# Altium project Alles.PrjPcb
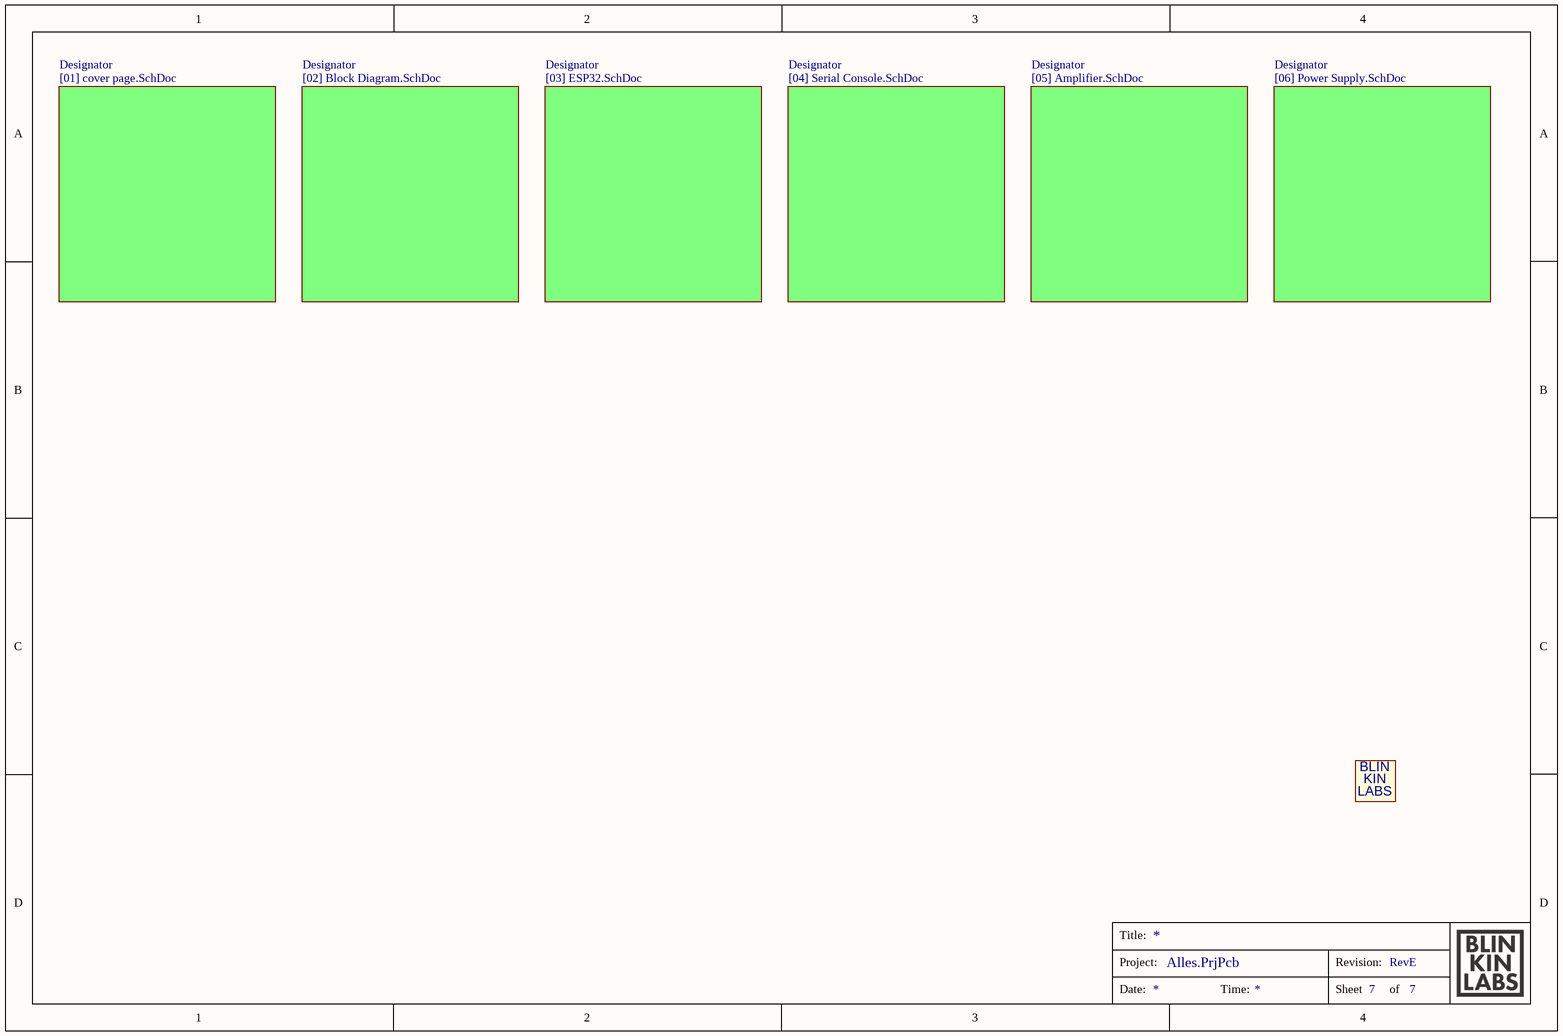
[diagram p0: Alles_base_project.SchDoc]
VersionRevision: RevE; Project: Alles
7 sheets, 72 parts. Net scope: flat (ports and power ports of the same name join across sheets).
Board file: Alles.PcbDoc
Sheets:
  Alles_base_project.SchDoc
    Designator = [03] ESP32.SchDoc
    Designator = [01] Cover Page.SchDoc
    Designator = [02] Block Diagram.SchDoc
    Designator = [04] Serial Console.SchDoc
    Designator = [06] Power Supply.SchDoc
    Designator = [05] Amplifier.SchDoc

## Sheet Alles_base_project.SchDoc
size A4; Organization: Blinkinlabs, LLC; DocumentNumber: 7; SheetNumber: 7; SheetTotal: 7

### Parts
L1  BLINKINLABS_LOGO  [BLINKINLABS_LOGO_SMALL]  (value not drawn)  (no BOM)

### Sub-sheets
Designator = [03] ESP32.SchDoc: no entries
Designator = [01] cover page.SchDoc: no entries
Designator = [02] Block Diagram.SchDoc: no entries
Designator = [04] Serial Console.SchDoc: no entries
Designator = [06] Power Supply.SchDoc: no entries
Designator = [05] Amplifier.SchDoc: no entries

### Notes on the sheet
- Title:
- Project:
- Revision:
- Date:
- Time:
- Sheet
- of
- (in symbol BLINKINLABS_LOGO) BLIN; KIN; LABS

### Library data of the parts
L1 = BLINKINLABS_LOGO: Square logo

## Sheet [03] ESP32.SchDoc: ESP32
size A4; Organization: Blinkinlabs, LLC; DocumentNumber: 3; SheetNumber: 3; SheetTotal: 7
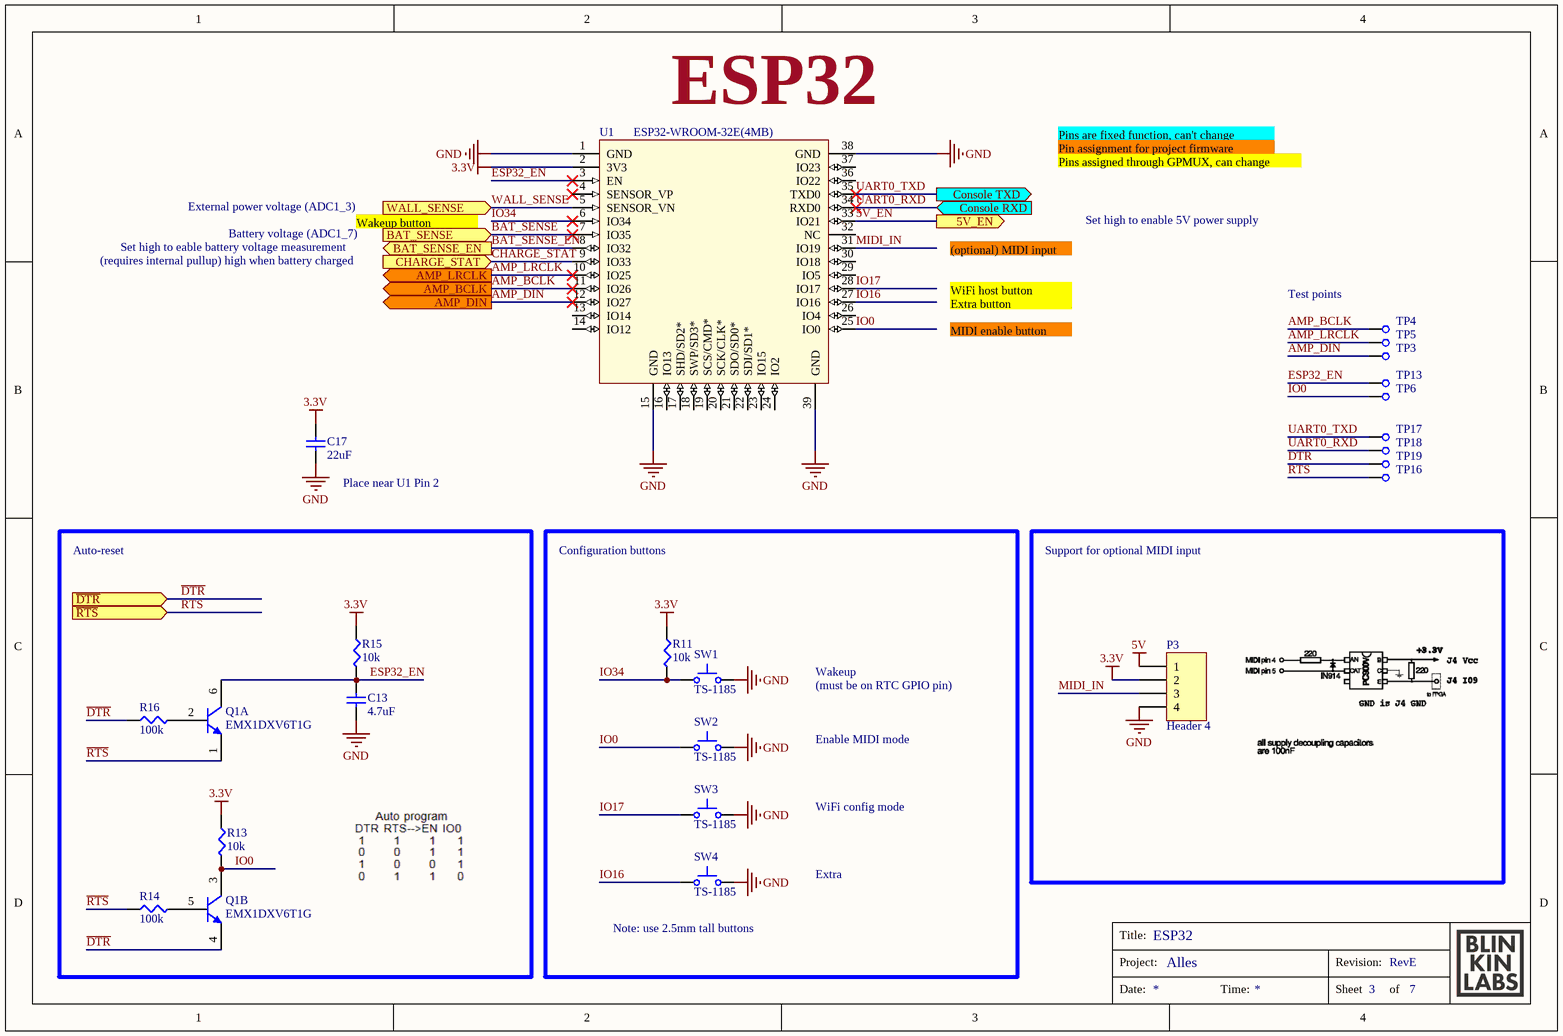
[diagram p1: [03] ESP32.SchDoc]

### Parts
C13  4.7uF  [CAPC1608X09L]
C17  22uF  [CAPC1608X09L]
P3  Header 4  [HDR1X4]
Q1  EMX1DXV6T1G  [ONSC-SOT-563-6-463A-01_V]  (parts A,B of 2)
R11  10k  [ERJ2G(0402)_L]
R13  10k  [ERJ2G(0402)_L]
R14  100k  [ERJ2G(0402)_L]
R15  10k  [ERJ2G(0402)_L]
R16  100k  [ERJ2G(0402)_L]
SW1  TS-1185  [TS-1185]
SW2  TS-1185  [TS-1185]
SW3  TS-1185  [TS-1185]
SW4  TS-1185  [TS-1185]
TP3  TEST_POINT  [TP-SMD-1mm]  (value not drawn)  (no BOM)
TP4  TEST_POINT  [TP-SMD-1mm]  (value not drawn)  (no BOM)
TP5  TEST_POINT  [TP-SMD-1mm]  (value not drawn)  (no BOM)
TP6  TEST_POINT  [TP-SMD-1mm]  (value not drawn)  (no BOM)
TP13  TEST_POINT  [TP-SMD-1mm]  (value not drawn)  (no BOM)
TP16  TEST_POINT  [TP-SMD-1mm]  (value not drawn)  (no BOM)
TP17  TEST_POINT  [TP-SMD-1mm]  (value not drawn)  (no BOM)
TP18  TEST_POINT  [TP-SMD-1mm]  (value not drawn)  (no BOM)
TP19  TEST_POINT  [TP-SMD-1mm]  (value not drawn)  (no BOM)
U1  ESP32-WROOM-32E(4MB)  [ESP32-WROOM-32-shortpad]

### Blocks framed on the sheet
Auto-reset: C13 Q1 R13-R16
Support for optional MIDI input: P3

### Ports
5V_EN (out), AMP_BCLK (out), AMP_DIN (out), AMP_LRCLK (out), BAT_SENSE (in), BAT_SENSE_EN (out), CHARGE_STAT (in), Console RXD (in), Console TXD (out), WALL_SENSE (in), ~{DTR} (in), ~{RTS} (in)

### Nets
3.3V: C17.1 P3.2 R11.1 R13.1 R15.1 U1.2(3V3)
5V: P3.1
GND: C13.2 C17.2 P3.4 SW1.2 SW2.2 SW3.2 SW4.2 U1.1(GND) U1.15(GND) U1.38(GND) U1.39(GND)
5V_EN: U1.33(IO21) ; port 5V_EN
AMP_BCLK: TP4.1(TP) U1.11(IO26) ; port AMP_BCLK
AMP_DIN: TP3.1(TP) U1.12(IO27) ; port AMP_DIN
AMP_LRCLK: TP5.1(TP) U1.10(IO25) ; port AMP_LRCLK
BAT_SENSE: U1.7(IO35) ; port BAT_SENSE
BAT_SENSE_EN: U1.8(IO32) ; port BAT_SENSE_EN
CHARGE_STAT: U1.9(IO33) ; port CHARGE_STAT
~{DTR}: Q1.4(E) R16.1 TP19.1(TP) ; port ~{DTR}
ESP32_EN: C13.1 Q1.6(C) R15.2 TP13.1(TP) U1.3(EN)
IO0: Q1.3(C) R13.2 SW2.1 TP6.1(TP) U1.25(IO0)
IO16: SW4.1 U1.27(IO16)
IO17: SW3.1 U1.28(IO17)
IO34: R11.2 SW1.1 U1.6(IO34)
MIDI_IN: P3.3 U1.31(IO19)
~{RTS}: Q1.1(E) R14.1 TP16.1(TP) ; port ~{RTS}
UART0_RXD: TP18.1(TP) U1.34(RXD0) ; port Console RXD
UART0_TXD: TP17.1(TP) U1.35(TXD0) ; port Console TXD
WALL_SENSE: U1.5(SENSOR_VN) ; port WALL_SENSE
NetQ1_2: Q1.2(B) R16.2
NetQ1_5: Q1.5(B) R14.2

Not connected (* = marked no-connect by the designer): U1 4(SENSOR_VP)* 13(IO14) 14(IO12) 16(IO13) 17(SHD/SD2*) 18(SWP/SD3*) 19(SCS/CMD*) 20(SCK/CLK*) 21(SDO/SD0*) 22(SDI/SD1*) 23(IO15) 24(IO2) 26(IO4) 29(IO5) 30(IO18) 32(NC) 36(IO22) 37(IO23)

### Notes on the sheet
- Pins are fixed function, can't change
- Pins assigned through GPMUX, can change
- Pin assignment for project firmware
- Set high to eable battery voltage measurement
- External power voltage (ADC1_3)
- Battery voltage (ADC1_7)
- Wakeup button
- (optional) MIDI input
- Set high to enable 5V power supply
- (requires internal pullup) high when battery charged
- Extra button
- WiFi host button
- Test points
- MIDI enable button
- (near C17) Place near U1 Pin 2
- Configuration buttons
- Wakeup
- (must be on RTC GPIO pin)
- Enable MIDI mode
- WiFi config mode
- Extra
- (near SW4) Note: use 2.5mm tall buttons
- Title:
- Project:
- Revision:
- Date:
- Time:
- Sheet
- of

### Library data of the parts
C13 = GRM185R61A475KE11D: CAP CER 4.7UF 10V X5R 0603; Manufacturer: Murata Electronics North America; Tolerance: ±10%; PartNumber: GRM185R61A475KE11D; Datasheets: http://www.murata.com/~/media/webrenewal/support/library/catalog/products/capacitor/mlcc/c02e.pdf; Image: //media.digikey.com/Renders/Murata%20Renders/ZRB-SERIES-0402.jpg; Digi-Key Part Number: 490-11988-1-ND; Series: GRM; Value: 4.7uF; Voltage: 10V; Temperature Coefficient: X5R; Operating Temperature: -55°C ~ 85°C; Features: -; Applications: General Purpose; Package / Case: 0603 (1608 Metric); Case/Package: 0603
C17 = GRM187R61A226ME15D: CAP CER 22UF 10V X5R 0603; Manufacturer: Murata Electronics North America; Tolerance: ±20%; PartNumber: GRM187R61A226ME15D; Datasheets: http://psearch.en.murata.com/capacitor/product/GRM187R61A226ME15%23.pdf; Image: //media.digikey.com/Renders/Murata%20Renders/ZRB-SERIES-0402.jpg; Digi-Key Part Number: 490-13243-1-ND; Series: GRM; Value: 22uF; Voltage: 10V; Temperature Coefficient: X5R; Operating Temperature: -55°C ~ 85°C; Features: Derating Recommended; Applications: General Purpose; Package / Case: 0603 (1608 Metric); Case/Package: 0603
P3 = Header 4: Header, 4-Pin; LatestRevisionDate: 17-Jul-2002; LatestRevisionNote: Re-released for DXP Platform.; Publisher: Altium Limited
Q1 = CMP-1048-00890-1: Dual NPN General Purpose Amplifier Transistors, 6-Pin SOT-563, Pb-Free, Tape and Reel; Manufacturer: On Semiconductor; IC Continuous (A): 0.1; ComponentLink3URL: http://www.onsemi.cn/pub_link/Collateral/463A-01.PDF; ComponentLink2URL: http://www.onsemi.com/pub_link/Collateral/EMX1DXV6T1-D.PDF; PackageDescription: 6-Pin Small Outline Transistor, Body 1.6 x 1.2 mm, Pitch 0.5 mm; ComponentLink1URL: http://www.onsemi.com/; ComponentLink1Description: Manufacturer URL; PartNumber: EMX1DXV6T1G; DatasheetVersion: Rev. 1; Polarity: Dual NPN; PackageReference: SOT-563-6-463A-01; RoHS: TRUE; ComponentLink2Description: Datasheet; Packing: Tape and Reel; Mounting Technology: Surface Mount; ComponentLink3Description: Package Specification; PackageVersion: Rev. F, 04/2005
R11 R13 R15 = ERJ-2GEJ103X: RES SMD 10K OHM 5% 1/10W 0402; Manufacturer: Panasonic Electronic Components; Power (Watts): 0.1W, 1/10W; Temperature Coefficient: ±200ppm/°C; PartNumber: ERJ-2GEJ103X; Datasheets: http://industrial.panasonic.com/www-cgi/jvcr13pz.cgi?E+PZ+3+AOA0001+ERJ2GEJ103X+7+WW; Image: //media.digikey.com/Photos/Panasonic%20Photos/ERJ-PA2-Series.jpg; Digi-Key Part Number: P10KJCT-ND; Series: ERJ; Value: 10k; Tolerance: ±5%; Composition: Thick Film; Features: Automotive AEC-Q200; Operating Temperature: -55°C ~ 155°C; Package / Case: 0402 (1005 Metric); Case/Package: 0402; Size / Dimension: 0.039" L x 0.020" W (1.00mm x 0.50mm); Height - Seated (Max): 0.016" (0.40mm); Number of Terminations: 2
R14 R16 = ERJ-2GEJ104X: RES SMD 100K OHM 5% 1/10W 0402; Manufacturer: Panasonic Electronic Components; Power (Watts): 0.1W, 1/10W; Temperature Coefficient: ±200ppm/°C; PartNumber: ERJ-2GEJ104X; Datasheets: http://industrial.panasonic.com/www-cgi/jvcr13pz.cgi?E+PZ+3+AOA0001+ERJ2GEJ104X+7+WW; Image: //media.digikey.com/Photos/Panasonic%20Photos/ERJ-PA2-Series.jpg; Digi-Key Part Number: P100KJCT-ND; Series: ERJ; Value: 100k; Tolerance: ±5%; Composition: Thick Film; Features: Automotive AEC-Q200; Operating Temperature: -55°C ~ 155°C; Package / Case: 0402 (1005 Metric); Case/Package: 0402; Size / Dimension: 0.039" L x 0.020" W (1.00mm x 0.50mm); Height - Seated (Max): 0.016" (0.40mm); Number of Terminations: 2
SW1-SW4 = TS-1185: Tact Switch, 3x4mm, no alignment pin, turtle style; Manufacturer: XKB; PartNumber: TS-1185
TP3-TP6 TP13 TP16-TP19 = TEST_POINT: Test point
U1 = ESP32-WROOM-32E(4MB): 32-bit MCU & 2.4 GHz Wi-Fi & Bluetooth/Bluetooth LE; Manufacturer: Espressif Systems; PartNumber: ESP32-WROOM-32E(4MB); LCSC PartNumber: C701341; Parameter 2: *

## Sheet [01] Cover Page.SchDoc: Cover Page
size A4; Organization: Blinkinlabs, LLC; DocumentNumber: 1; SheetNumber: 1; SheetTotal: 7
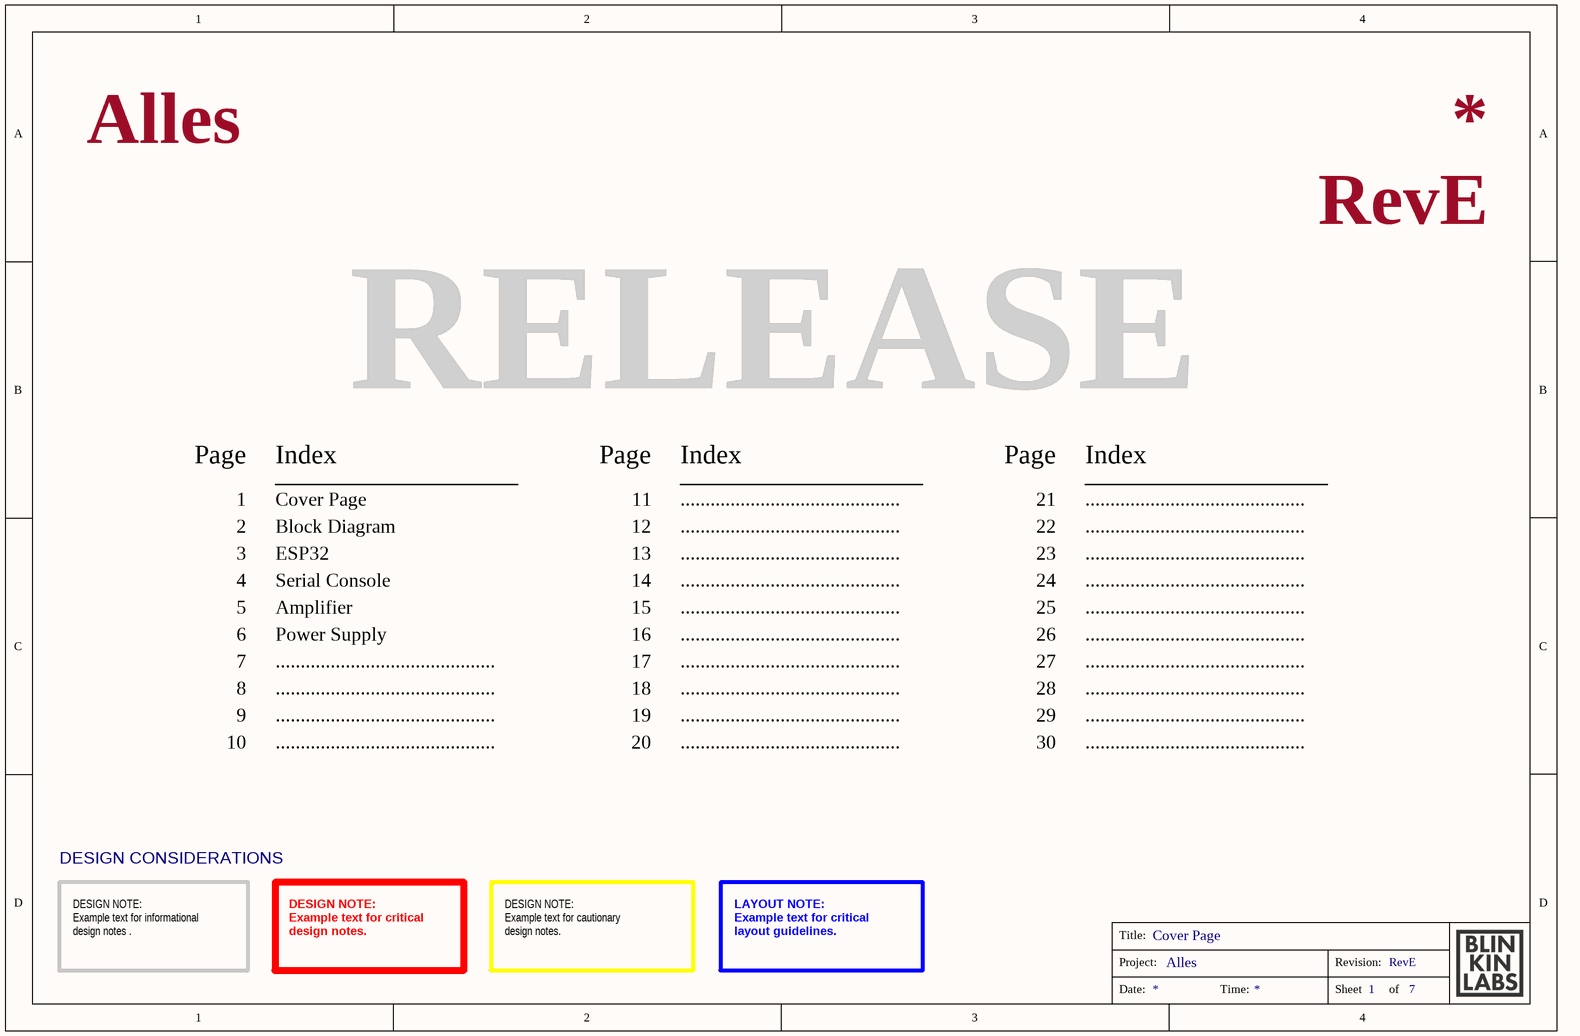
[diagram p2: [01] Cover Page.SchDoc]

### Notes on the sheet
- RELEASE
- Page
- 1
- Index
- Cover Page
- 11
- ............................................
- 21
- 2
- 3
- Block Diagram
- ESP32
- 12
- 13
- 22
- 23
- 4
- 5
- 6
- Serial Console
- Amplifier
- Power Supply
- 14
- 15
- 16
- 24
- 25
- 26
- 7
- 8
- 17
- 18
- 27
- 28
- 9
- 10
- 19
- 20
- 29
- 30
- DESIGN CONSIDERATIONS
- DESIGN NOTE:
  Example text for informational
  design notes .
- DESIGN NOTE:
  Example text for critical
  design notes.
- DESIGN NOTE:
  Example text for cautionary
  design notes.
- LAYOUT NOTE:
  Example text for critical
  layout guidelines.
- Title:
- Project:
- Revision:
- Date:
- Time:
- Sheet
- of

## Sheet [02] Block Diagram.SchDoc: Block Diagram
size A4; Organization: Blinkinlabs, LLC; DocumentNumber: 2; SheetNumber: 2; SheetTotal: 7
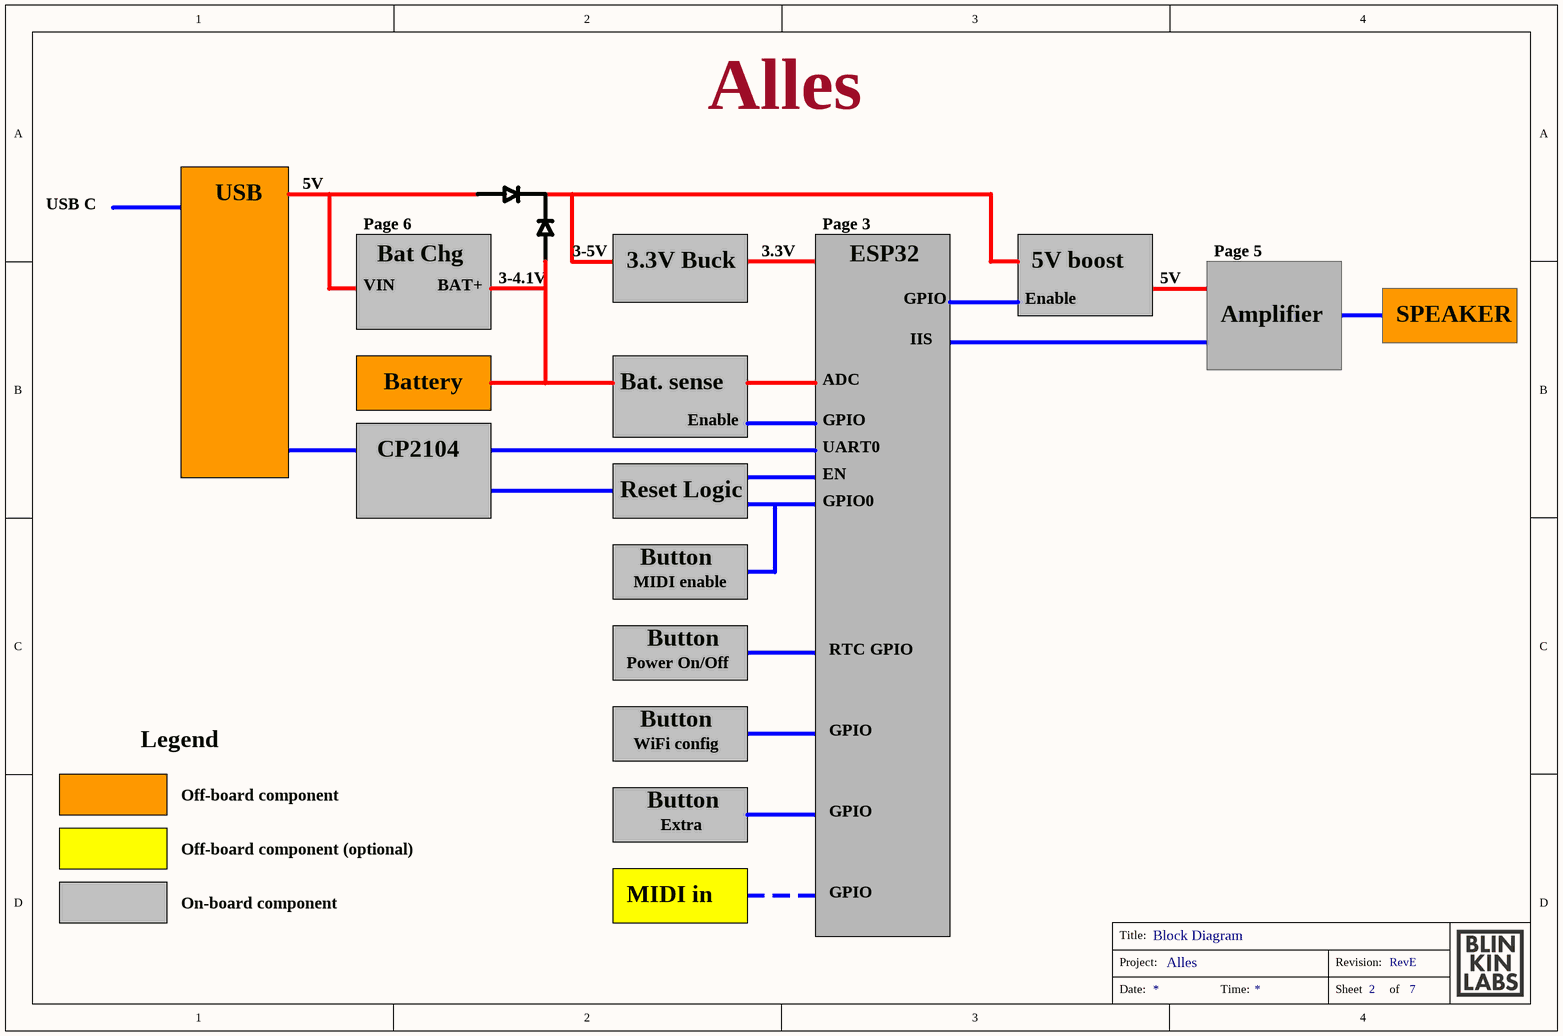
[diagram p3: [02] Block Diagram.SchDoc]

### Notes on the sheet
- USB C
- USB
- 5V
- Page 6
- Page 3
- VIN
- Bat Chg
- BAT+
- 3-4.1V
- 3-5V
- 3.3V Buck
- 3.3V
- ESP32
- GPIO
- Enable
- 5V boost
- Page 5
- ADC
- IIS
- Amplifier
- SPEAKER
- Battery
- Bat. sense
- CP2104
- Reset Logic
- UART0
- EN
- GPIO0
- Button
- MIDI enable
- RTC GPIO
- Power On/Off
- Legend
- Off-board component
- WiFi config
- Off-board component (optional)
- Extra
- On-board component
- MIDI in
- Title:
- Project:
- Revision:
- Date:
- Time:
- Sheet
- of

## Sheet [04] Serial Console.SchDoc: USB-to-Serial converter
size A4; Organization: Blinkinlabs, LLC; DocumentNumber: 4; SheetNumber: 4; SheetTotal: 7
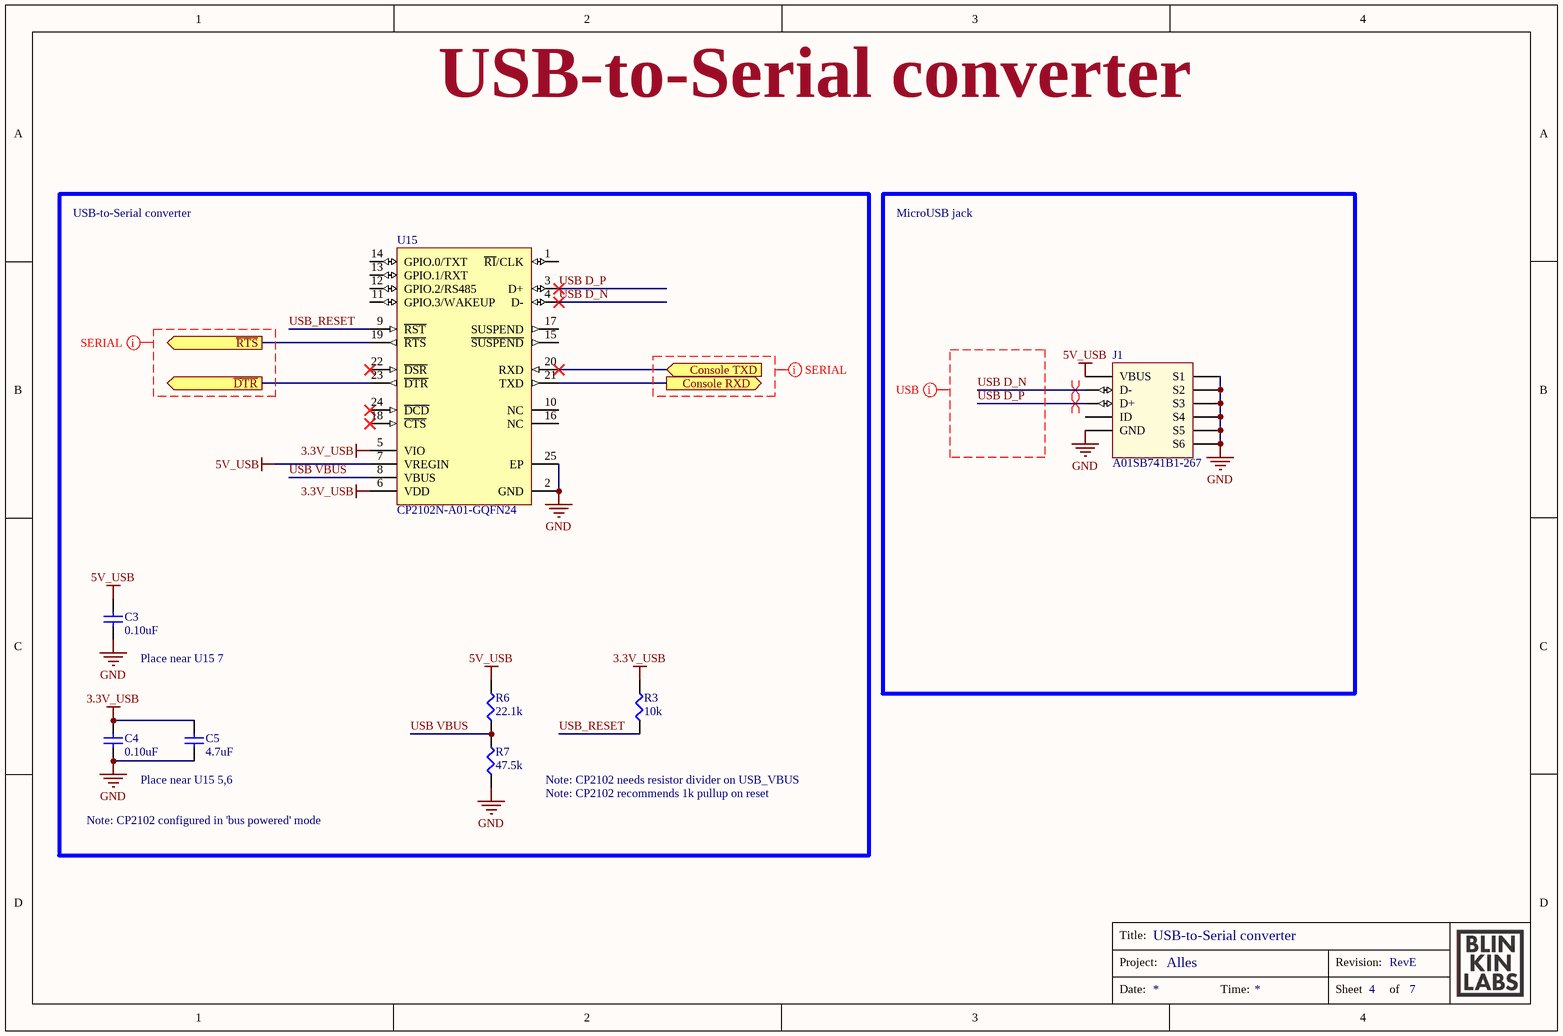
[diagram p4: [04] Serial Console.SchDoc]

### Parts
C3  0.10uF  [CAPC1005X06L]
C4  0.10uF  [CAPC1005X06L]
C5  4.7uF  [CAPC1608X09L]
J1  A01SB741B1-267  [A01SB741B1-267]
R3  10k  [ERJ2G(0402)_L]
R6  22.1k  [ERJ2G(0402)_L]
R7  47.5k  [ERJ2G(0402)_L]
U15  CP2102N-A01-GQFN24  [SLAB-QFN-24-2550x2550TP_A_V]

### Blocks framed on the sheet
MicroUSB jack: J1

### Ports
Console RXD (out), Console TXD (in), ~{DTR} (out), ~{RTS} (out)

### Nets
3.3V_USB: C4.2 C5.1 R3.2 U15.5(VIO) U15.6(VDD)
5V_USB: C3.2 J1.VBUS R6.2 U15.7(VREGIN)
GND: C3.1 C4.1 C5.2 J1.GND J1.S1 J1.S2 J1.S3 J1.S4 J1.S5 J1.S6 R7.1 U15.2(GND) U15.25(EP)
~{DTR}: U15.23(~{DTR}) ; port ~{DTR}
~{RTS}: U15.19(~{RTS}) ; port ~{RTS}
UART0_RXD: U15.21(TXD) ; port Console RXD
UART0_TXD: U15.20(RXD) ; port Console TXD
USB D_N: J1.D- U15.4(D-)
USB D_P: J1.D+ U15.3(D+)
USB VBUS: R6.1 R7.2 U15.8(VBUS)
USB_RESET: R3.1 U15.9(~{RST})

Not connected (* = marked no-connect by the designer): J1 ID; U15 1(~{RI}/CLK) 10(NC) 11(GPIO.3/WAKEUP) 12(GPIO.2/RS485) 13(GPIO.1/RXT) 14(GPIO.0/TXT) 15(~{SUSPEND}) 16(NC) 17(SUSPEND) 18(~{CTS})* 22(~{DSR})* 24(~{DCD})*

### Layout directives
net class USB: USB D_N, USB D_P
differential pair: USB D_N, USB D_P
net class SERIAL: (no net found under the mark)

### Notes on the sheet
- USB-to-Serial converter
- (near C3) Place near U15 7
- Place near U15 5,6
- Note: CP2102 needs resistor divider on USB_VBUS
- Note: CP2102 configured in 'bus powered' mode
- Note: CP2102 recommends 1k pullup on reset
- Title:
- Project:
- Revision:
- Date:
- Time:
- Sheet
- of

### Library data of the parts
C3 C4 = GRM152R61A104ME19D: CAP CER 0.1UF 10V X5R 0402; Manufacturer: Murata Electronics North America; Tolerance: ±20%; Datasheets: http://www.murata.com/~/media/webrenewal/support/library/catalog/products/capacitor/mlcc/c02e.pdf; Image: //media.digikey.com/Renders/Murata%20Renders/ZRB-SERIES-0402.jpg; Digi-Key Part Number: 490-10009-1-ND; Packaging: Cut Tape (CT); Series: GRM; Value: 0.10uF; Voltage: 10V; Temperature Coefficient: X5R; Operating Temperature: -55°C ~ 85°C; Features: Derating Recommended; Applications: General Purpose; Package / Case: 0402 (1005 Metric); Case/Package: 0402; PartNumber: GRM152R61A104ME19D
C5 = GRM185R61A475KE11D: as C13 on sheet [03] ESP32; PartNumber: GRM185R61A475KE11D; Datasheets: http://www.murata.com/~/media/webrenewal/support/library/catalog/products/capacitor/mlcc/c02e.pdf; Image: //media.digikey.com/Renders/Murata%20Renders/ZRB-SERIES-0402.jpg; Digi-Key Part Number: 490-11988-1-ND; Series: GRM; Value: 4.7uF; Voltage: 10V; Temperature Coefficient: X5R; Operating Temperature: -55°C ~ 85°C; Features: -; Applications: General Purpose; Package / Case: 0603 (1608 Metric); Case/Package: 0603
J1 = A01SB741B1-267: Micro USB B type 四脚全插牛角; PartNumber: Unknown/Generic; Manufacturer: Unknown/Generic
R3 = ERJ-2GEJ103X: as R11 on sheet [03] ESP32; PartNumber: ERJ-2GEJ103X; Datasheets: http://industrial.panasonic.com/www-cgi/jvcr13pz.cgi?E+PZ+3+AOA0001+ERJ2GEJ103X+7+WW; Image: //media.digikey.com/Photos/Panasonic%20Photos/ERJ-PA2-Series.jpg; Digi-Key Part Number: P10KJCT-ND; Series: ERJ; Value: 10k; Tolerance: ±5%; Composition: Thick Film; Features: Automotive AEC-Q200; Operating Temperature: -55°C ~ 155°C; Package / Case: 0402 (1005 Metric); Case/Package: 0402; Size / Dimension: 0.039" L x 0.020" W (1.00mm x 0.50mm); Height - Seated (Max): 0.016" (0.40mm); Number of Terminations: 2
R6 = ERJ-2RKF2212X: RES SMD 22.1K OHM 1% 1/10W 0402; Manufacturer: Panasonic Electronic Components; Power (Watts): 0.1W, 1/10W; Temperature Coefficient: ±100ppm/°C; PartNumber: ERJ-2RKF2212X; Datasheets: http://industrial.panasonic.com/www-cgi/jvcr13pz.cgi?E+PZ+3+AOA0002+ERJ2RKF2212X+7+WW; Image: //media.digikey.com/Photos/Panasonic%20Photos/ERJ-PA2-Series.jpg; Digi-Key Part Number: P22.1KLCT-ND; Series: ERJ; Value: 22.1k; Tolerance: ±1%; Composition: Thick Film; Features: Automotive AEC-Q200; Operating Temperature: -55°C ~ 155°C; Package / Case: 0402 (1005 Metric); Case/Package: 0402; Size / Dimension: 0.039" L x 0.020" W (1.00mm x 0.50mm); Height - Seated (Max): 0.016" (0.40mm); Number of Terminations: 2
R7 = ERJ-2RKF4752X: RES SMD 47.5K OHM 1% 1/10W 0402; Manufacturer: Panasonic Electronic Components; Power (Watts): 0.1W, 1/10W; Temperature Coefficient: ±100ppm/°C; PartNumber: ERJ-2RKF4752X; Datasheets: http://industrial.panasonic.com/www-cgi/jvcr13pz.cgi?E+PZ+3+AOA0002+ERJ2RKF4752X+7+WW; Image: //media.digikey.com/Photos/Panasonic%20Photos/ERJ-PA2-Series.jpg; Digi-Key Part Number: P47.5KLCT-ND; Series: ERJ; Value: 47.5k; Tolerance: ±1%; Composition: Thick Film; Features: Automotive AEC-Q200; Operating Temperature: -55°C ~ 155°C; Package / Case: 0402 (1005 Metric); Case/Package: 0402; Size / Dimension: 0.039" L x 0.020" W (1.00mm x 0.50mm); Height - Seated (Max): 0.016" (0.40mm); Number of Terminations: 2
U15 = CMP-2000-07570-1: USBXpress(TM) Family, 4 GPIOs, 2.2 to 3.6 V, -40 to 85 degC, 24-Pin QFN, RoHS; Manufacturer: Silicon Labs; Max Supply Voltage: 3.6V; Min Supply Voltage: 3V; Datasheet Version: Rev. 1.1, 08/2016; Max Operating Temperature: 85degC; Case\/Package: QFN; Number of Pins: 24; Min Operating Temperature: -40degC; Mounting Technology: SurfaceMount; Manufacturer URL: http://www.silabs.com/; RoHSCompliant: False; Package Reference: QFN-24-2550x2550TP_A; Datasheet URL: http://www.silabs.com/documents/public/data-sheets/cp2102n-datasheet.pdf; Package Description: 24-Pin Quad Flat No-lead Package, Body 4 x 4 mm, Pitch 0.5 mm; REACH SVHC: Unknown

## Sheet [06] Power Supply.SchDoc: Power Supply
size A4; Organization: Blinkinlabs, LLC; DocumentNumber: 6; SheetNumber: 6; SheetTotal: 7
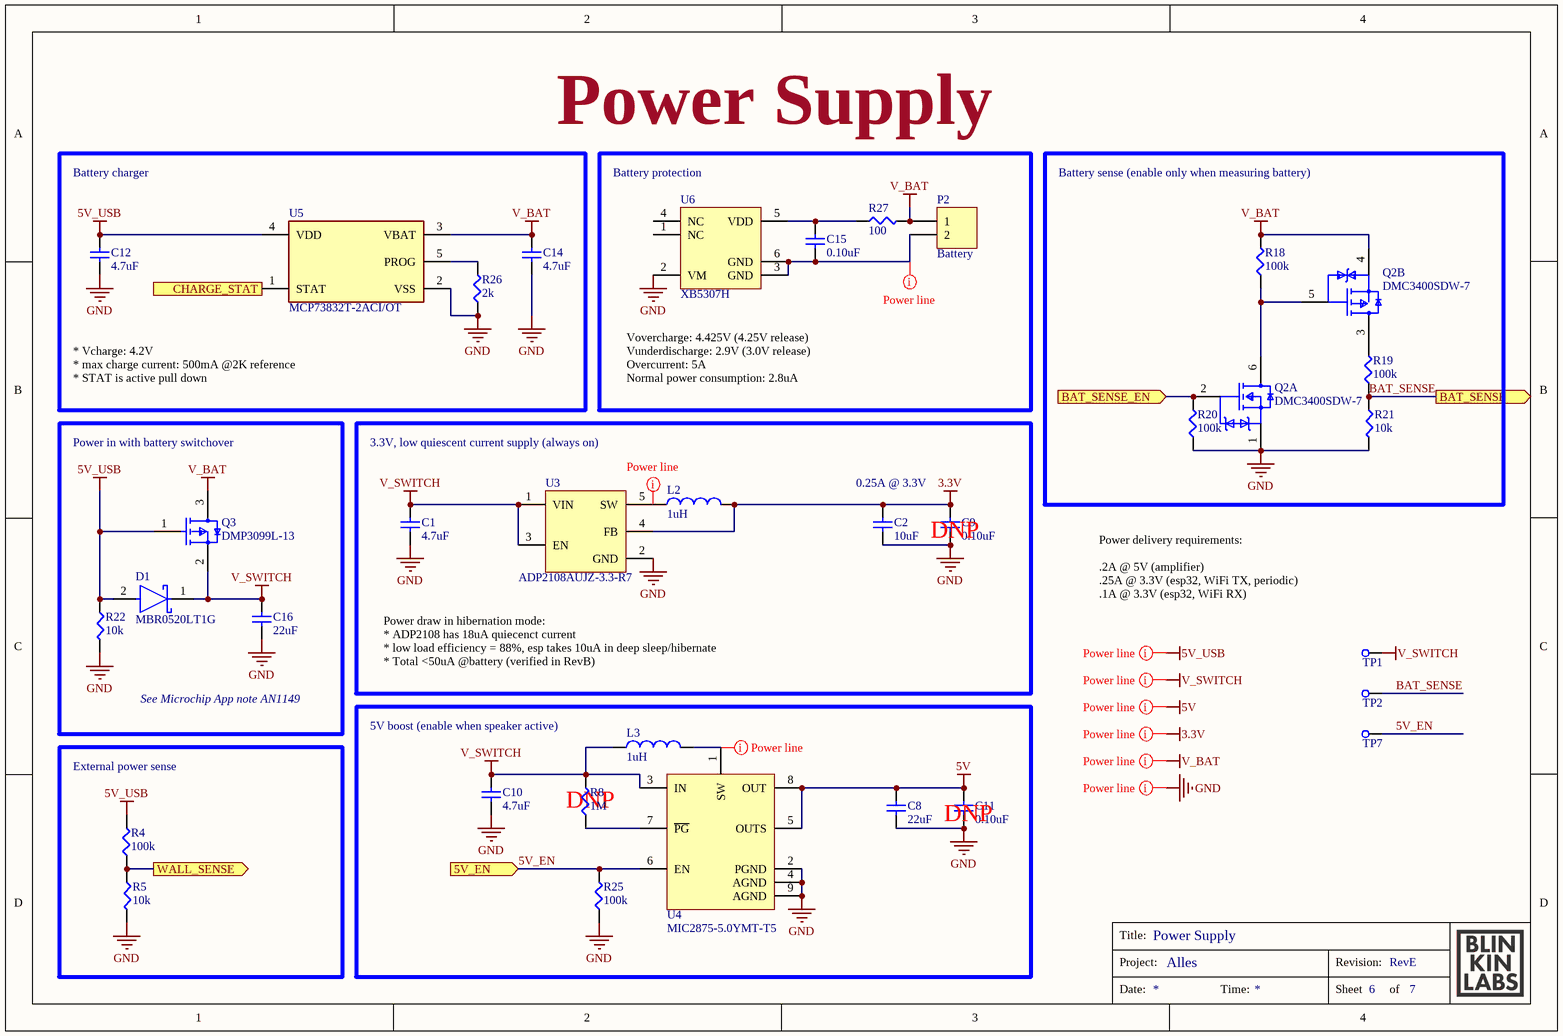
[diagram p5: [06] Power Supply.SchDoc]

### Parts
C1  4.7uF  [CAPC1608X09L]
C2  10uF  [CAPC1608X09L]
C8  22uF  [CAPC1608X09L]
C9  0.10uF  [CAPC1005X06L]
C10  4.7uF  [CAPC1608X09L]
C11  0.10uF  [CAPC1005X06L]
C12  4.7uF  [CAPC1608X09L]
C14  4.7uF  [CAPC1608X09L]
C15  0.10uF  [CAPC1005X06L]
C16  22uF  [CAPC1608X09L]
D1  MBR0520LT1G  [FP-425-04-IPC_C]
L2  1uH  [FNR201610S]
L3  1uH  [FNR201610S]
P2  Battery  [HDR1X2]
Q2  DMC3400SDW-7  [FP-SOT363-MFG]  (parts A,B of 2)
Q3  DMP3099L-13  [FP-SOT23-IPC_A]
R4  100k  [ERJ2G(0402)_L]
R5  10k  [ERJ2G(0402)_L]
R8  1M  [ERJ2G(0402)_L]
R18  100k  [ERJ2G(0402)_L]
R19  100k  [ERJ2G(0402)_L]
R20  100k  [ERJ2G(0402)_L]
R21  10k  [ERJ2G(0402)_L]
R22  10k  [ERJ2G(0402)_L]
R25  100k  [ERJ2G(0402)_L]
R26  2k  [ERJ2G(0402)_L]
R27  100  [ERJ2G(0402)_L]
TP1  TEST_POINT  [TP-SMD-1mm]  (value not drawn)  (no BOM)
TP2  TEST_POINT  [TP-SMD-1mm]  (value not drawn)  (no BOM)
TP7  TEST_POINT  [TP-SMD-1mm]  (value not drawn)  (no BOM)
U3  ADP2108AUJZ-3.3-R7  [SOT95P280X100-5N]
U4  MIC2875-5.0YMT-T5  [TDFN22-8LD-PL-1 (hand drawn)]
U5  MCP73832T-2ACI/OT  [FP-C04-091-OT-MFG]
U6  XB5307H  [SOT95P280X125-6N-3]

### Blocks framed on the sheet
Battery charger: C12 C14 R26 U5
Battery protection: C15 P2 R27 U6
Battery sense (enable only when measuring battery): Q2 R18-R21
DNP: C1 C2 C9 L2 U3
External power sense: R4 R5

### Ports
5V_EN (in), BAT_SENSE (out), BAT_SENSE_EN (in), CHARGE_STAT (out), WALL_SENSE (out)

### Nets
3.3V: C2.1 C9.2 L2.2 U3.4(FB)
5V: C8.1 C11.2 U4.5(OUTS) U4.8(OUT)
5V_USB: C12.1 D1.2(A) Q3.1(G) R4.2 R22.1 U5.4(VDD)
GND: C1.2 C2.2 C8.2 C9.1 C10.2 C11.1 C12.2 C14.2 C16.2 Q2.1(S1) R5.2 R20.1 R21.2 R22.2 R25.1 R26.1 U3.2(GND) U4.2(PGND) U4.4(AGND) U4.9(AGND) U5.2(VSS) U6.2(VM)
V_BAT: C14.1 P2.1 Q2.4(S2) Q3.3(D) R18.2 R27.2 U5.3(VBAT)
V_SWITCH: C1.1 C10.1 C16.1 D1.1(C) L3.1 Q3.2(S) R8.2 TP1.1(TP) U3.1(VIN) U3.3(EN) U4.3(IN)
5V_EN: R25.2 TP7.1(TP) U4.6(EN) ; port 5V_EN
BAT_SENSE: R19.1 R21.1 TP2.1(TP) ; port BAT_SENSE
BAT_SENSE_EN: Q2.2(G1) R20.2 ; port BAT_SENSE_EN
CHARGE_STAT: U5.1(STAT) ; port CHARGE_STAT
WALL_SENSE: R4.1 R5.1 ; port WALL_SENSE
NetC15_1: C15.1 P2.2 U6.3(GND) U6.6(GND)
NetC15_2: C15.2 R27.1 U6.5(VDD)
NetL2_1: L2.1 U3.5(SW)
NetL3_2: L3.2 U4.1(SW)
NetQ2_3: Q2.3(D2) R19.2
NetQ2_5: Q2.5(G2) Q2.6(D1) R18.1
NetR8_1: R8.1 U4.7(~{PG})
NetR26_2: R26.2 U5.5(PROG)

Not connected (* = marked no-connect by the designer): U6 1(NC) 4(NC)

### Layout directives
net class POWER: 3.3V, 5V, 5V_USB, GND, NetC15_1, NetL2_1, NetL3_2, V_BAT, V_SWITCH

### Notes on the sheet
- Vovercharge: 4.425V (4.25V release)
  Vunderdischarge: 2.9V (3.0V release)
  Overcurrent: 5A
  Normal power consumption: 2.8uA
- Power in with battery switchover
- * Vcharge: 4.2V
  * max charge current: 500mA @2K reference
  * STAT is active pull down
- 3.3V, low quiescent current supply (always on)
- 0.25A @ 3.3V
- (near TP1) Power delivery requirements:
  .2A @ 5V (amplifier)
  .25A @ 3.3V (esp32, WiFi TX, periodic)
  .1A @ 3.3V (esp32, WiFi RX)
- See Microchip App note AN1149
- Power draw in hibernation mode:
  * ADP2108 has 18uA quiecenct current
  * low load efficiency = 88%, esp takes 10uA in deep sleep/hibernate
  * Total <50uA @battery (verified in RevB)
- 5V boost (enable when speaker active)
- (near R8) DNP
- (near C11) DNP
- Labels drawn without touching a wire or pin: 3.3V, 5V, 5V_USB, GND, V_BAT, V_SWITCH
- Title:
- Project:
- Revision:
- Date:
- Time:
- Sheet
- of

### Library data of the parts
C1 C10 C12 C14 = GRM188R61A475KE15D: CAP CER 4.7UF 10V X5R 0603; Manufacturer: Murata Electronics North America; Tolerance: ±10%; PartNumber: GRM188R61A475KE15D; Datasheets: http://www.murata.com/~/media/webrenewal/support/library/catalog/products/capacitor/mlcc/c02e.pdf; Image: //media.digikey.com/Renders/Murata%20Renders/ZRB-SERIES-0402.jpg; Digi-Key Part Number: 490-10477-1-ND; Series: GRM; Value: 4.7uF; Voltage: 10V; Temperature Coefficient: X5R; Operating Temperature: -55°C ~ 85°C; Features: Derating Recommended; Applications: General Purpose; Package / Case: 0603 (1608 Metric); Case/Package: 0603
C2 = GRM188R61A106KE69D: CAP CER 10UF 10V X5R 0603; Manufacturer: Murata Electronics North America; Tolerance: ±10%; PartNumber: GRM188R61A106KE69D; Datasheets: http://www.murata.com/~/media/webrenewal/support/library/catalog/products/capacitor/mlcc/c02e.pdf; Image: //media.digikey.com/Renders/Murata%20Renders/ZRB-SERIES-0402.jpg; Digi-Key Part Number: 490-10474-1-ND; Series: GRM; Value: 10uF; Voltage: 10V; Temperature Coefficient: X5R; Operating Temperature: -55°C ~ 85°C; Features: Derating Recommended; Applications: General Purpose; Package / Case: 0603 (1608 Metric); Case/Package: 0603
C8 C16 = GRM187R61A226ME15D: as C17 on sheet [03] ESP32; PartNumber: GRM187R61A226ME15D; Datasheets: http://psearch.en.murata.com/capacitor/product/GRM187R61A226ME15%23.pdf; Image: //media.digikey.com/Renders/Murata%20Renders/ZRB-SERIES-0402.jpg; Digi-Key Part Number: 490-13243-1-ND; Series: GRM; Value: 22uF; Voltage: 10V; Temperature Coefficient: X5R; Operating Temperature: -55°C ~ 85°C; Features: Derating Recommended; Applications: General Purpose; Package / Case: 0603 (1608 Metric); Case/Package: 0603
C9 C11 C15 = GRM155R61C104KA88J: CAP CER 0.1UF 16V X5R 0402; Manufacturer: Murata Electronics North America; Tolerance: ±10%; PartNumber: GRM155R61C104KA88J; Datasheets: http://www.murata.com/~/media/webrenewal/support/library/catalog/products/capacitor/mlcc/c02e.pdf; Image: //media.digikey.com/Renders/Murata%20Renders/ZRB-SERIES-0402.jpg; Digi-Key Part Number: 490-6310-1-ND; Packaging: Cut Tape (CT); Series: GRM; Value: 0.10uF; Voltage: 16V; Temperature Coefficient: X5R; Operating Temperature: -55°C ~ 85°C; Features: -; Applications: General Purpose; Package / Case: 0402 (1005 Metric); Case/Package: 0402
D1 = CMP-1055-00425-2: DIODE SCHOTTKY 20V 500MA SOD123; Polarity: Standard; Peak Non-Repetitive Surge Current: 5.5A; Forward Voltage: 385mV; Element Configuration: Single; Peak Reverse Current: 250uA; Max Repetitive Reverse Voltage (Vrrm): 20V; Voltage Rating (DC): 20V; Case/Package: SOD-123-2; Number of Pins: 2; Output Current: 500mA; Min Operating Temperature: -65°C; Lead Free: Lead Free; REACH SVHC: No SVHC; Max Reverse Voltage (DC): 20V; Termination: SMD/SMT; Average Rectified Current: 500mA; Max Surge Current: 5.5A; Package Quantity: 3000; Height: 1.12mm; Current Rating: 500mA; Forward Current: 500mA; Max Forward Surge Current (Ifsm): 5.5A; Packaging: Tape and Reel; Length: 2.69mm; Radiation Hardening: No; Max Reverse Leakage Current: 250uA; Width: 1.6mm; Contact Plating: Tin; Max Operating Temperature: 125°C
L2 L3 = FNR201610S1R0MT: 1uH ±20% 1.45A 114mΩ SMD,2.0x1.6x1.0mm Power Inductors RoHS; Manufacturer: Changjiang Microelectronics Tech; PartNumber: FNR201610S1R0MT; Datasheets: https://datasheet.lcsc.com/szlcsc/1805291223_cjiang-Changjiang-Microelectronics-Tech-FNR201610S1R0MT_C167670.pdf; LCSC PartNumber: C167670; Inductance: 1uH; Tolerance: ±20%; DC Resistance: 114mΩ; Saturation current: 1.45A; Packaging: Cut Tape (CT); Package / Case: SMD,2.0x1.6x1.0mm; Case/Package: SMD,2.0x1.6x1.0mm
P2 = Header 2: Header, 2-Pin; LatestRevisionDate: 17-Jul-2002; LatestRevisionNote: Re-released for DXP Platform.; Publisher: Altium Limited
Q2 = CMP-12801-000006-1: MOSFET N/P-CH 30V SOT363; Manufacturer: Diodes Inc.; Standoff Height: 0mm; Number Of Channels: 2; Pulse Drain Current: 4/-3A; Max Forward Diode Voltage: 1.2/-1.2V; Max Junction Temp: +150°C; Drain To Source Resistance: 0.2/0.36Ω; Depletion Mode: False; Continuous Drain Current: 0.65/-0.45A; Number Of P Channels: 1; Drain To Source Breakdown Voltage: 30/-30V; Rthja Max: 406°C/W; Gate To Source Voltage: 20V; Power Dissipation: 0.31W; Turn On Delay Time: 3.8/5.7ns; Threshold Vgs Min: 0.8/-1V; Typ Forward Diode Voltage: 0.8/-0.8V; Turn Off Delay Time: 25.2/35ns; Threshold Vgs Max: 1.6/-2.6V; Lead Free: Yes; Temperature: -55°C to +150°C; Package: SOT363; Temperature Range High: +150°C; Height: 1.1mm; Device Class L2: Transistors; RoHS: TRUE; Category: Trans; Mouser Description: MOSFET 30V Comp Pair Enh 20Vgs 55pF 0.6nC; Device Class L3: MOSFETs; ComponentLink2Description: Datasheet; Automotive: No; ComponentLink2URL: https://www.diodes.com/assets/Datasheets/DMC3400SDW.pdf; Number Of N Channels: 1; Footprint Url: https://www.diodes.com/assets/Package-Files/SOT363.pdf; Digikey Description: MOSFET N/P-CH 30V SOT363; Device Class L1: Discrete Semiconductors; Manufacturer Part Number: DMC3400SDW-7; Drain To Source Voltage: 30/-30V; Ipc Land Pattern Name: SOT65P210X100-6; Temperature Range Low: -55°C; Octopart: https://octopart.com/dmc3400sdw-7-diodes+inc.-57605013
Q3 = CMP-12801-000102-1: MOSFET P-CH 30V 3.8A SOT23; Fall Time: 15ns; Turn-Off Delay Time: 31ns; Rds On Max: 65mR; Rise Time: 5ns; Gate to Source Voltage (Vgs): 20V; Number of Channels: 1; Max Power Dissipation: 1.08W; Turn-On Delay Time: 4.8ns; Element Configuration: Single; Input Capacitance: 563pF; Weight: 0.000282oz; Case/Package: TO-236-3; Drain to Source Voltage (Vdss): 30V; Package Quantity: 10000; Min Operating Temperature: -55°C; Radiation Hardening: No; REACH SVHC: No SVHC; Drain to Source Resistance: 65mR; Packaging: Tape and Reel; Lead Free: Lead Free; Number of Pins: 3; Mount: Surface Mount; Max Operating Temperature: 150°C; Continuous Drain Current (ID): 3.8A
R4 R18-R20 R25 = ERJ-2GEJ104X: as R14 on sheet [03] ESP32; PartNumber: ERJ-2GEJ104X; Datasheets: http://industrial.panasonic.com/www-cgi/jvcr13pz.cgi?E+PZ+3+AOA0001+ERJ2GEJ104X+7+WW; Image: //media.digikey.com/Photos/Panasonic%20Photos/ERJ-PA2-Series.jpg; Digi-Key Part Number: P100KJCT-ND; Series: ERJ; Value: 100k; Tolerance: ±5%; Composition: Thick Film; Features: Automotive AEC-Q200; Operating Temperature: -55°C ~ 155°C; Package / Case: 0402 (1005 Metric); Case/Package: 0402; Size / Dimension: 0.039" L x 0.020" W (1.00mm x 0.50mm); Height - Seated (Max): 0.016" (0.40mm); Number of Terminations: 2
R5 R21 R22 = ERJ-2GEJ103X: as R11 on sheet [03] ESP32; PartNumber: ERJ-2GEJ103X; Datasheets: http://industrial.panasonic.com/www-cgi/jvcr13pz.cgi?E+PZ+3+AOA0001+ERJ2GEJ103X+7+WW; Image: //media.digikey.com/Photos/Panasonic%20Photos/ERJ-PA2-Series.jpg; Digi-Key Part Number: P10KJCT-ND; Series: ERJ; Value: 10k; Tolerance: ±5%; Composition: Thick Film; Features: Automotive AEC-Q200; Operating Temperature: -55°C ~ 155°C; Package / Case: 0402 (1005 Metric); Case/Package: 0402; Size / Dimension: 0.039" L x 0.020" W (1.00mm x 0.50mm); Height - Seated (Max): 0.016" (0.40mm); Number of Terminations: 2
R8 = ERJ-2GEJ105X: RES SMD 1M OHM 5% 1/10W 0402; Manufacturer: Panasonic Electronic Components; Power (Watts): 0.1W, 1/10W; Temperature Coefficient: ±200ppm/°C; PartNumber: ERJ-2GEJ105X; Datasheets: http://industrial.panasonic.com/www-cgi/jvcr13pz.cgi?E+PZ+3+AOA0001+ERJ2GEJ105X+7+WW; Image: //media.digikey.com/Photos/Panasonic%20Photos/ERJ-PA2-Series.jpg; Digi-Key Part Number: P1.0MJCT-ND; Series: ERJ; Value: 1M; Tolerance: ±5%; Composition: Thick Film; Features: Automotive AEC-Q200; Operating Temperature: -55°C ~ 155°C; Package / Case: 0402 (1005 Metric); Case/Package: 0402; Size / Dimension: 0.039" L x 0.020" W (1.00mm x 0.50mm); Height - Seated (Max): 0.016" (0.40mm); Number of Terminations: 2
R26 = ERJ-2GEJ202X: RES SMD 2K OHM 5% 1/10W 0402; Manufacturer: Panasonic Electronic Components; Power (Watts): 0.1W, 1/10W; Temperature Coefficient: ±200ppm/°C; PartNumber: ERJ-2GEJ202X; Datasheets: http://industrial.panasonic.com/www-cgi/jvcr13pz.cgi?E+PZ+3+AOA0001+ERJ2GEJ202X+7+WW; Image: //media.digikey.com/Photos/Panasonic%20Photos/ERJ-PA2-Series.jpg; Digi-Key Part Number: P2.0KJCT-ND; Series: ERJ; Value: 2k; Tolerance: ±5%; Composition: Thick Film; Features: Automotive AEC-Q200; Operating Temperature: -55°C ~ 155°C; Package / Case: 0402 (1005 Metric); Case/Package: 0402; Size / Dimension: 0.039" L x 0.020" W (1.00mm x 0.50mm); Height - Seated (Max): 0.016" (0.40mm); Number of Terminations: 2
R27 = ERJ-2RKF1000X: RES SMD 100 OHM 1% 1/10W 0402; Manufacturer: Panasonic Electronic Components; Power (Watts): 0.1W, 1/10W; Temperature Coefficient: ±100ppm/°C; PartNumber: ERJ-2RKF1000X; Datasheets: http://industrial.panasonic.com/www-cgi/jvcr13pz.cgi?E+PZ+3+AOA0002+ERJ2RKF1000X+7+WW; Image: //media.digikey.com/Photos/Panasonic%20Photos/ERJ-PA2-Series.jpg; Digi-Key Part Number: P100LCT-ND; Series: ERJ; Value: 100; Tolerance: ±1%; Composition: Thick Film; Features: Automotive AEC-Q200; Operating Temperature: -55°C ~ 155°C; Package / Case: 0402 (1005 Metric); Case/Package: 0402; Size / Dimension: 0.039" L x 0.020" W (1.00mm x 0.50mm); Height - Seated (Max): 0.016" (0.40mm); Number of Terminations: 2
TP1 TP2 TP7 = TEST_POINT: Test point
U3 = ADP2108AUJZ-3.3-R7: Compact, 600 mA, 3 MHz, Step-Down DC-to-DC Converter, 3.3V; Manufacturer: *; PartNumber: ADP2108AUJZ-3.3-R7; DigiKey PartNumber: ADP2108AUJZ-3.3-R7CT-ND; LCSC PartNumber: C143875
U4 = MIC2875-5.0YMT-T5: 4.8A ISW, Synchronous Boost Regulator with Bi-Directional Load Disconnect; Manufacturer: Microchip; PartNumber: MIC2875-5.0YMT-T5; Digikey PartNumber: MIC2875-5.0YMT-T5CT-ND
U5 = CMP-0133-00138-2: IC LI-ION/LI-POLY CTRLR SOT23-5; Output Current: 10mA; Output Voltage: 4.2V; Max Output Current: 500mA; Max Power Dissipation: 1.54W; Min Output Voltage: 4.168V; Number of Channels: 1; Max Supply Voltage: 6V; Min Supply Voltage: 3.75V; Max Output Voltage: 4.5V; Case/Package: SOT-23; Lead Free: Lead Free; Termination: SMD/SMT; Min Operating Temperature: -40°C; Max Operating Temperature: 85°C; Height: 1.3mm; Length: 3.1mm; Mount: Surface Mount; Package Quantity: 3000; Number of Pins: 5; Packaging: Tape and Reel; REACH SVHC: No SVHC; Contact Plating: Tin; Width: 1.8mm; Number of Cells: 1; Number of Outputs: 1; Power Dissipation: 1.54W; Max Charge Current: 500mA; Max Input Voltage: 6V; Radiation Hardening: No
U6 = XB5307H: Single-cell Li-ion/Li-polymer rechargeable battery pack protection chip w2.90V cutorff; Manufacturer: XySemi; PartNumber: XB5307H; LCSC PartNumber: C154942

## Sheet [05] Amplifier.SchDoc: DAC
size A4; Organization: Blinkinlabs, LLC; DocumentNumber: 5; SheetNumber: 5; SheetTotal: 7
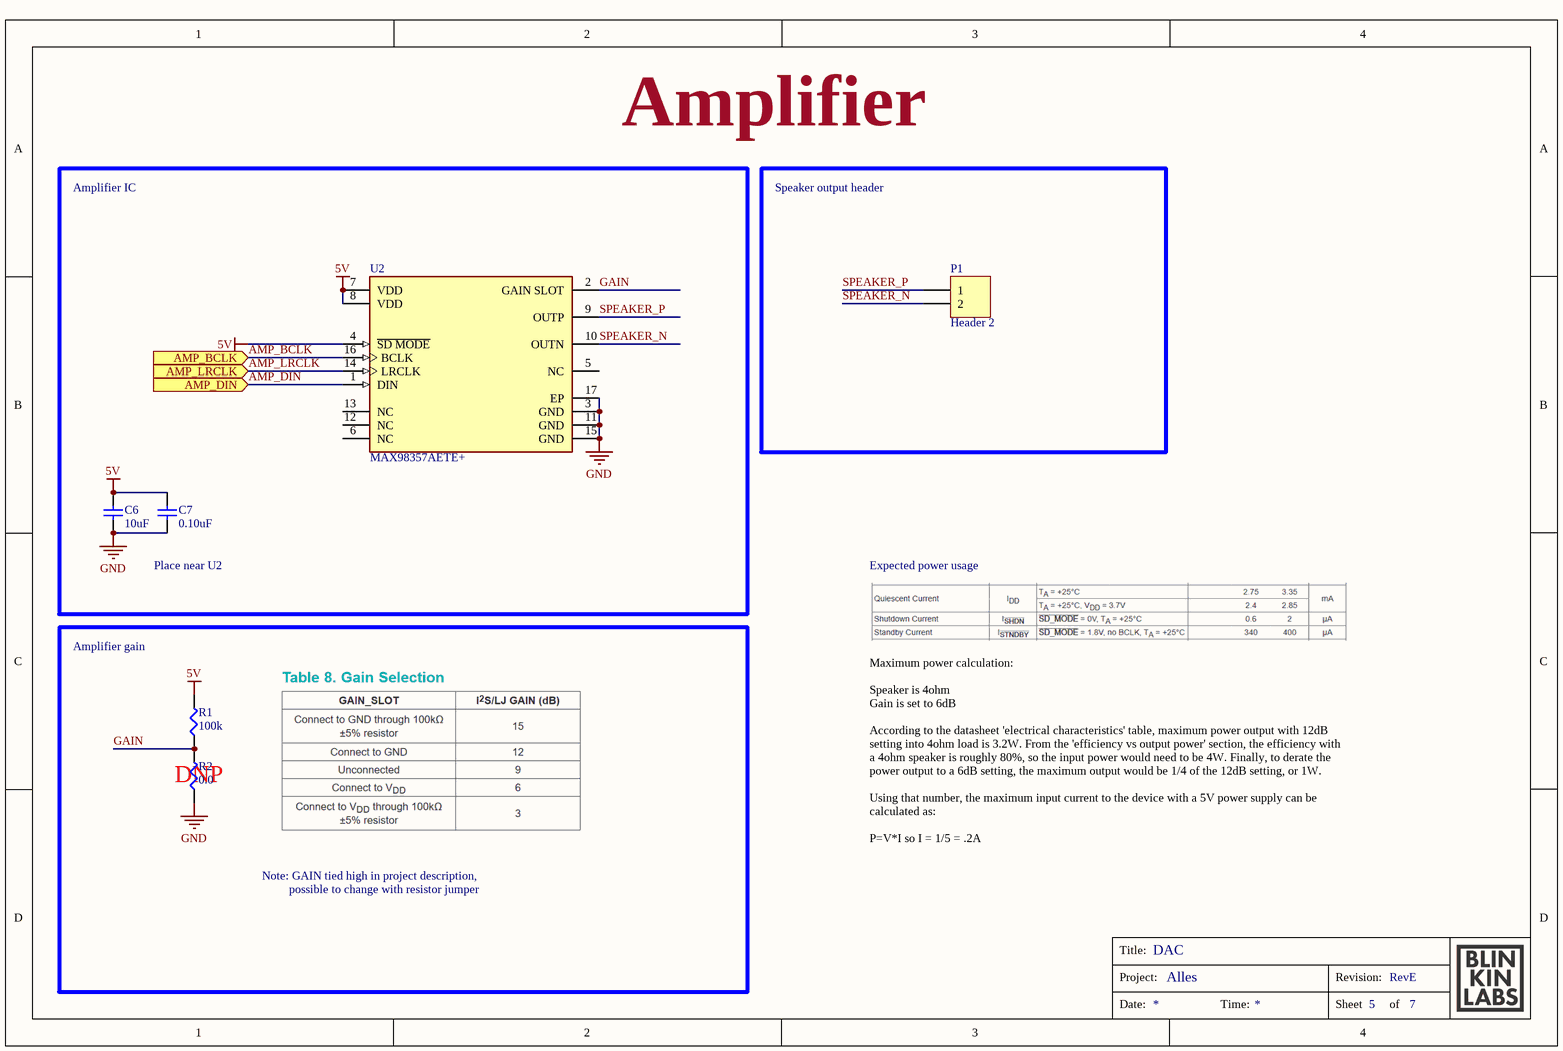
[diagram p6: [05] Amplifier.SchDoc]

### Parts
C6  10uF  [CAPC1608X09L]
C7  0.10uF  [CAPC1005X06L]
P1  Header 2  [HDR1X2]
R1  100k  [ERJ2G(0402)_L]
R2  0.0  [ERJ2G(0402)_L]
U2  MAX98357AETE+  [FP-T1633-4-MFG]

### Blocks framed on the sheet
Speaker output header: P1
DNP: R1 R2

### Ports
AMP_BCLK (in), AMP_DIN (in), AMP_LRCLK (in)

### Nets
5V: C6.1 C7.2 R1.2 U2.4(~{SD_MODE}) U2.7(VDD) U2.8(VDD)
GND: C6.2 C7.1 R2.1 U2.3(GND) U2.11(GND) U2.15(GND) U2.17(EP)
AMP_BCLK: U2.16(BCLK) ; port AMP_BCLK
AMP_DIN: U2.1(DIN) ; port AMP_DIN
AMP_LRCLK: U2.14(LRCLK) ; port AMP_LRCLK
GAIN: R1.1 R2.2 U2.2(GAIN_SLOT)
SPEAKER_N: P1.2 U2.10(OUTN)
SPEAKER_P: P1.1 U2.9(OUTP)

Not connected (* = marked no-connect by the designer): U2 5(NC) 6(NC) 12(NC) 13(NC)

### Notes on the sheet
- Amplifier
- Amplifier IC
- Place near U2
- Expected power usage
- Amplifier gain
- Maximum power calculation:
  Speaker is 4ohm
  Gain is set to 6dB
  According to the datasheet 'electrical characteristics' table, maximum power output with 12dB setting into 4ohm load is 3.2W. From the 'efficiency vs output power' section, the efficiency with a 4ohm speaker is roughly 80%, so the input power would need to be 4W. Finally, to derate the power output to a 6dB setting, the maximum output would be 1/4 of the 12dB setting, or 1W.
  Using that number, the maximum input current to the device with a 5V power supply can be calculated as:
  P=V*I so I = 1/5 = .2A
- Note: GAIN tied high in project description,
- possible to change with resistor jumper
- Title:
- Project:
- Revision:
- Date:
- Time:
- Sheet
- of

### Library data of the parts
C6 = GRM188R61A106KE69D: as C2 on sheet [06] Power Supply; PartNumber: GRM188R61A106KE69D; Datasheets: http://www.murata.com/~/media/webrenewal/support/library/catalog/products/capacitor/mlcc/c02e.pdf; Image: //media.digikey.com/Renders/Murata%20Renders/ZRB-SERIES-0402.jpg; Digi-Key Part Number: 490-10474-1-ND; Series: GRM; Value: 10uF; Voltage: 10V; Temperature Coefficient: X5R; Operating Temperature: -55°C ~ 85°C; Features: Derating Recommended; Applications: General Purpose; Package / Case: 0603 (1608 Metric); Case/Package: 0603
C7 = GRM152R61A104ME19D: as C3 on sheet [04] Serial Console; Datasheets: http://www.murata.com/~/media/webrenewal/support/library/catalog/products/capacitor/mlcc/c02e.pdf; Image: //media.digikey.com/Renders/Murata%20Renders/ZRB-SERIES-0402.jpg; Digi-Key Part Number: 490-10009-1-ND; Packaging: Cut Tape (CT); Series: GRM; Value: 0.10uF; Voltage: 10V; Temperature Coefficient: X5R; Operating Temperature: -55°C ~ 85°C; Features: Derating Recommended; Applications: General Purpose; Package / Case: 0402 (1005 Metric); Case/Package: 0402; PartNumber: GRM152R61A104ME19D
P1 = Header 2: Header, 2-Pin; LatestRevisionDate: 17-Jul-2002; LatestRevisionNote: Re-released for DXP Platform.; Publisher: Altium Limited
R1 = ERJ-2GEJ104X: as R14 on sheet [03] ESP32; PartNumber: ERJ-2GEJ104X; Datasheets: http://industrial.panasonic.com/www-cgi/jvcr13pz.cgi?E+PZ+3+AOA0001+ERJ2GEJ104X+7+WW; Image: //media.digikey.com/Photos/Panasonic%20Photos/ERJ-PA2-Series.jpg; Digi-Key Part Number: P100KJCT-ND; Series: ERJ; Value: 100k; Tolerance: ±5%; Composition: Thick Film; Features: Automotive AEC-Q200; Operating Temperature: -55°C ~ 155°C; Package / Case: 0402 (1005 Metric); Case/Package: 0402; Size / Dimension: 0.039" L x 0.020" W (1.00mm x 0.50mm); Height - Seated (Max): 0.016" (0.40mm); Number of Terminations: 2
R2 = ERJ-2GE0R00X: RES SMD 0.0OHM JUMPER 1/10W 0402; Manufacturer: Panasonic Electronic Components; Power (Watts): 0.1W, 1/10W; PartNumber: ERJ-2GE0R00X; Datasheets: http://industrial.panasonic.com/www-cgi/jvcr13pz.cgi?E+PZ+3+AOA0001+ERJ2GE0R00X+7+WW; Image: //media.digikey.com/Photos/Panasonic%20Photos/ERJ-PA2-Series.jpg; Digi-Key Part Number: P0.0JCT-ND; Series: ERJ; Value: 0.0; Tolerance: Jumper; Composition: Thick Film; Features: Automotive AEC-Q200; Temperature Coefficient: -; Operating Temperature: -55°C ~ 155°C; Package / Case: 0402 (1005 Metric); Case/Package: 0402; Size / Dimension: 0.039" L x 0.020" W (1.00mm x 0.50mm); Height - Seated (Max): 0.016" (0.40mm); Number of Terminations: 2
U2 = CMP-05698-000004-1: IC AMP CLASS D MONO 3.2W 16TQFN; Supply Type: Single; Load Impedance: 4R; Power Supply Rejection Ratio (PSRR): 77dB; Gain: 15dB; Max Supply Voltage: 5.5V; Operating Supply Voltage: 5V; Max Power Dissipation: 1.666W; Max Output Current: 1.6A; Min Supply Voltage: 2.5V; Operating Supply Current: 2.75mA; Number of Channels: 1; Max Operating Temperature: 85°C; Number of Pins: 16; Mount: Surface Mount; Package Quantity: 490; Packaging: Rail/Tube; Min Operating Temperature: -40°C; Voltage Gain: 15dB; Max Output Power: 3.2W; Output Power: 3.2W; Contact Plating: Tin; Radiation Hardening: No

## Nets that join several sheets
3.3V: [03] ESP32 (6 pins), [06] Power Supply (C2.1 C9.2 L2.2 U3.4)
5V: [03] ESP32 (P3.1), [06] Power Supply (C8.1 C11.2 U4.5 U4.8), [05] Amplifier (6 pins)
5V_USB: [04] Serial Console (C3.2 J1.VBUS R6.2 U15.7), [06] Power Supply (6 pins)
GND: [03] ESP32 (11 pins), [04] Serial Console (13 pins), [06] Power Supply (22 pins), [05] Amplifier (7 pins)
5V_EN: [03] ESP32 (U1.33), [06] Power Supply (R25.2 TP7.1 U4.6)
AMP_BCLK: [03] ESP32 (TP4.1 U1.11), [05] Amplifier (U2.16)
AMP_DIN: [03] ESP32 (TP3.1 U1.12), [05] Amplifier (U2.1)
AMP_LRCLK: [03] ESP32 (TP5.1 U1.10), [05] Amplifier (U2.14)
BAT_SENSE: [03] ESP32 (U1.7), [06] Power Supply (R19.1 R21.1 TP2.1)
BAT_SENSE_EN: [03] ESP32 (U1.8), [06] Power Supply (Q2.2 R20.2)
CHARGE_STAT: [03] ESP32 (U1.9), [06] Power Supply (U5.1)
~{DTR}: [03] ESP32 (Q1.4 R16.1 TP19.1), [04] Serial Console (U15.23)
~{RTS}: [03] ESP32 (Q1.1 R14.1 TP16.1), [04] Serial Console (U15.19)
UART0_RXD: [03] ESP32 (TP18.1 U1.34), [04] Serial Console (U15.21)
UART0_TXD: [03] ESP32 (TP17.1 U1.35), [04] Serial Console (U15.20)
WALL_SENSE: [03] ESP32 (U1.5), [06] Power Supply (R4.1 R5.1)